# Altium schematic sheet 5.5Vto5VBuck.SchDoc: 5V BUCK
size 431 x 279 mm; ApprovedBy: CHEN CHEN; CheckedBy: CHEN CHEN; Author: CHEN CHEN; DrawnBy: CHEN CHEN; Engineer: CHEN CHEN; Organization: Upenn; Address1: ADDRESS 1; Address2: ADDRESS 2; Address3: ADDRESS 3; Address4: ADDRESS 4; Revision: -; SheetNumber: 3; SheetTotal: 9; ENG_APP_DATE: --/--/--; DSN_APP_DATE: --/--/--; CHK_APP_DATE: --/--/--
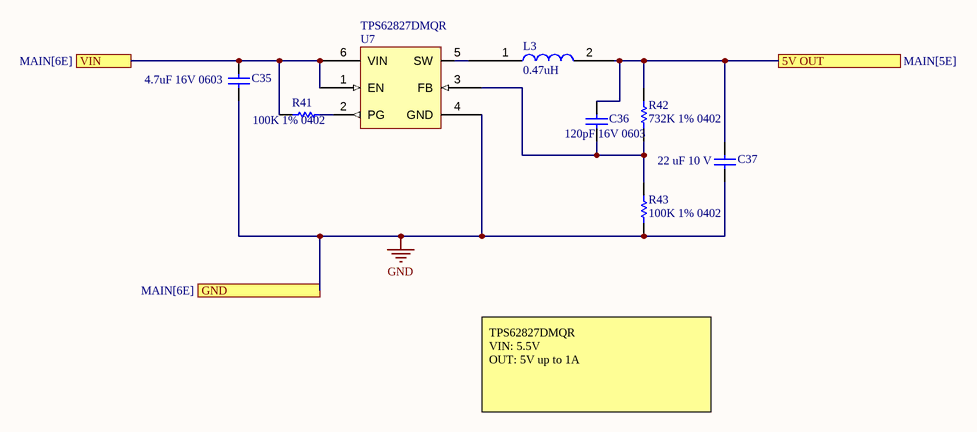
[diagram p0: 5.5Vto5VBuck.SchDoc]

## Parts
C35  4.7uF 16V 0603  [CAPC0603(1608)100_N]
C36  120pF 16V 0603  [CAPC0603(1608)100_M]
C37  22 uF 10 V  [CAPC1608X100X20ML10]
L3  0.47uH  [RESC0603X55N]
R41  100K 1% 0402  [RESC0402(1005)_M]
R42  732K 1% 0402  [RESC0402(1005)_M]
R43  100K 1% 0402  [RESC0402(1005)_M]
U7  TPS62827DMQR  [Texas_Instruments_DMQ0006A_MFG]

## Ports
5V OUT (see MAIN[5E]), GND (see MAIN[6E]), VIN (see MAIN[6E])

## Nets
GND: C35.1 C37.1 R43.1 U7.4(GND) ; port GND
5V OUT: C36.2 C37.2 L3.2 R42.2 ; port 5V OUT
VIN: C35.2 R41.1 U7.1(EN) U7.6(VIN) ; port VIN
NetC36_1: C36.1 R42.1 R43.2 U7.3(FB)
NetL3_1: L3.1 U7.5(SW)
NetR41_2: R41.2 U7.2(PG)

## Notes on the sheet
- TPS62827DMQR
  VIN: 5.5V
  OUT: 5V up to 1A
- DWG. NO.
- REV.
- SHT.
- THIS DOCUMENT AND THE DATA DISCLOSED HEREIN OR HEREWITH IS THE PROPERTY OF ALTIUM LIMITED AND MAY BE FREELY DISTRIBUTED IN WHOLE. NO RIGHTS ARE RESERVED OR EXPRESS OR IMPLIED WARANTEE GIVEN.
- REVISION
- DESCRIPTION
- DATE
- APPROVED
- ENG:
- APPROVALS
- PROJECT
- DSN:
- CHK:
- REFERENCE DOCUMENTS
- PROJECT REVISION:
- TITLE
- DOCUMENT REVISION:
- DESIGN ITEM:
- BOM:
- FAB DWG:
- PCB DWG:
- ASSY DWG:
- SCALE:
- SIZE
- B
- CAGE CODE
- FILE NAME
- DWG NO.
- SHEET
- OF
- REV

## Library data of the parts
C35 = CMP-1035-02788-1: CAP 4.7uF 16V ±10% 0603 (1608 Metric) Thickness 1mm SMD; Case-Metric: 1608; Tolerance: Â±10%; Case-EIA: 0603; Value: 4.7uF; Technology: SMT; Rated Voltage: 16 V; Max Thickness: 1 mm
C36 = CMP-1035-01309-1: CAP 120pF 16V ±5% 0603 (1608 Metric) Thickness 1mm SMD; Case-Metric: 1608; Case-EIA: 0603; Tolerance: Â±5%; Max Thickness: 1 mm; Technology: SMT; Value: 120pF; Rated Voltage: 16 V
C37 = CMP-2000-05441-1: Chip Capacitor, 22 uF, +/- 20%, 10 V, -55 to 85 degC, 0603 (1608 Metric), RoHS, Tape and Reel; Manufacturer: TDK; PCN Part Number: MLCCPartNumberChange30/Nov/2012; Voltage - Rated: 10V; Product Training Modules: CSeriesGeneralApplicationsSEAT,CCV,andTVCLDesignToolsGuidetoReplacinganElectrolyticCapacitorwithanMLCC; Other Names: 445-9077-1; Design Resources: 20WNon-IsolatedBuckLEDDriverUsingPLLNK460KG; Online Catalog: CSeries,GeneralPurpose; Capacitance: 22µF; Temperature Coefficient: X5R; Kits: 445-9014-KIT-ND-KITMLCC100PF-22UF060310-50V; Packaging: CutTape(CT); Standard Package: 1; Package / Case: 0603(1608Metric); Lead Style: -; Features: -; Ratings: -; Operating Temperature: -55degC~85degC; Applications: GeneralPurpose; Package Reference: 603; Datasheet URL: http://download.siliconexpert.com/pdfs/2015/4/21/15/54/45/779/tdk_/manual/37024850441143360mlcc_commercial_general_en.pdf; Datasheet Version: Mar-15; Mounting Type: SurfaceMount,MLCC; Lead Spacing: -; Size / Dimension: 0.063"Lx0.031"W(1.60mmx0.80mm); Height - Seated (Max): -; Package Description: 2-Pin Surface Mount Device, Body 1.6 x 0.8 mm; Manufacturer URL: http://www.tdk.com/; RoHS Information: RoHSCertificate-MLCC; Tolerance: ±20%; Series: C; Thickness (Max): 0.035"(0.90mm); Family: CeramicCapacitors; Category: Capacitors
L3 = TFM160808ALC-R47MTAA: Inductor Power Shielded Thin Film 0.47uH 20% 1MHz Metal 2.6A 0.062Ohm DCR 0603 T/R; Manufacturer: TDK; Inductance: 470nH; Current Rating: 2.7A; Saturation Current: 2A; DC Resistance (DCR): 62mR; Supplier 1: Digi-Key; Manufacturer Part Number: TFM160808ALC-R47MTAA; RoHS: Yes; Category: Fixed Inductors; Stock 1: 1133; Pricing 1: 1=0.43000, 10=0.38000, 25=0.33240, 50=0.28500, 100=0.26120, 250=0.23752, 500=0.22324, 1000=0.17100 (USD); Mount: Surface Mount; Case/Package: 0603; Core Material: Metal; Case Code (Imperial): 0603; Case Code (Metric): 1608; Resistor Type: Thin Film; Packaging: Cut Tape; Tolerance: 20%; Shielding: Shielded; Test Frequency: 1MHz; RoHS Compliant: Yes; ComponentLink1URL: https://product.tdk.com/info/en/catalog/datasheets/inductor_commercial_power_tfm160808alc_en.pdf?src-supplier=Digi-Key; ComponentLink1Description: https://product.tdk.com/info/en/catalog/datasheets/inductor_commercial_power_tfm160808alc_en.pdf?src-supplier=Digi-Key; Supplier Part Number 1: 445-174891-1-ND
R41 R43 = CMP-1011-00736-1: 100K 0.063W 1% 0402 (1005 Metric)  SMD; Value: 100000.00 Ohm; Case-EIA: 0402; Case-Metric: 1005; Power: 0.063 W; Tolerance: 1 %; Technology: SMT
R42 = CMP-1011-00834-1: 732K 0.063W 1% 0402 (1005 Metric)  SMD; Case-EIA: 0402; Case-Metric: 1005; Value: 732000.00 Ohm; Tolerance: 1 %; Power: 0.063 W; Technology: SMT
U7 = TPS62827DMQR: 2.4V-5.5V input, 4A step-down converter with 1% Accuracy in 1.5mm x 1.5mm QFN 6-VSON-HR -40 to 125; Manufacturer: Texas Instruments; Supplier 1: Digi-Key; Manufacturer Part Number: TPS62827DMQR; RoHS: Yes; Category: Voltage Regulators - Switching; Pricing 1: 1=1.93000, 10=1.73000, 25=1.63240, 100=1.30590, 250=1.14268, 500=1.11004, 1000=0.88150 (USD); RoHS Compliant: Yes; Supplier Part Number 1: 296-TPS62827DMQRCT-ND